# EAGLE design sensorboard_spectrometer_rev0 (EAGLE 6.5.0)
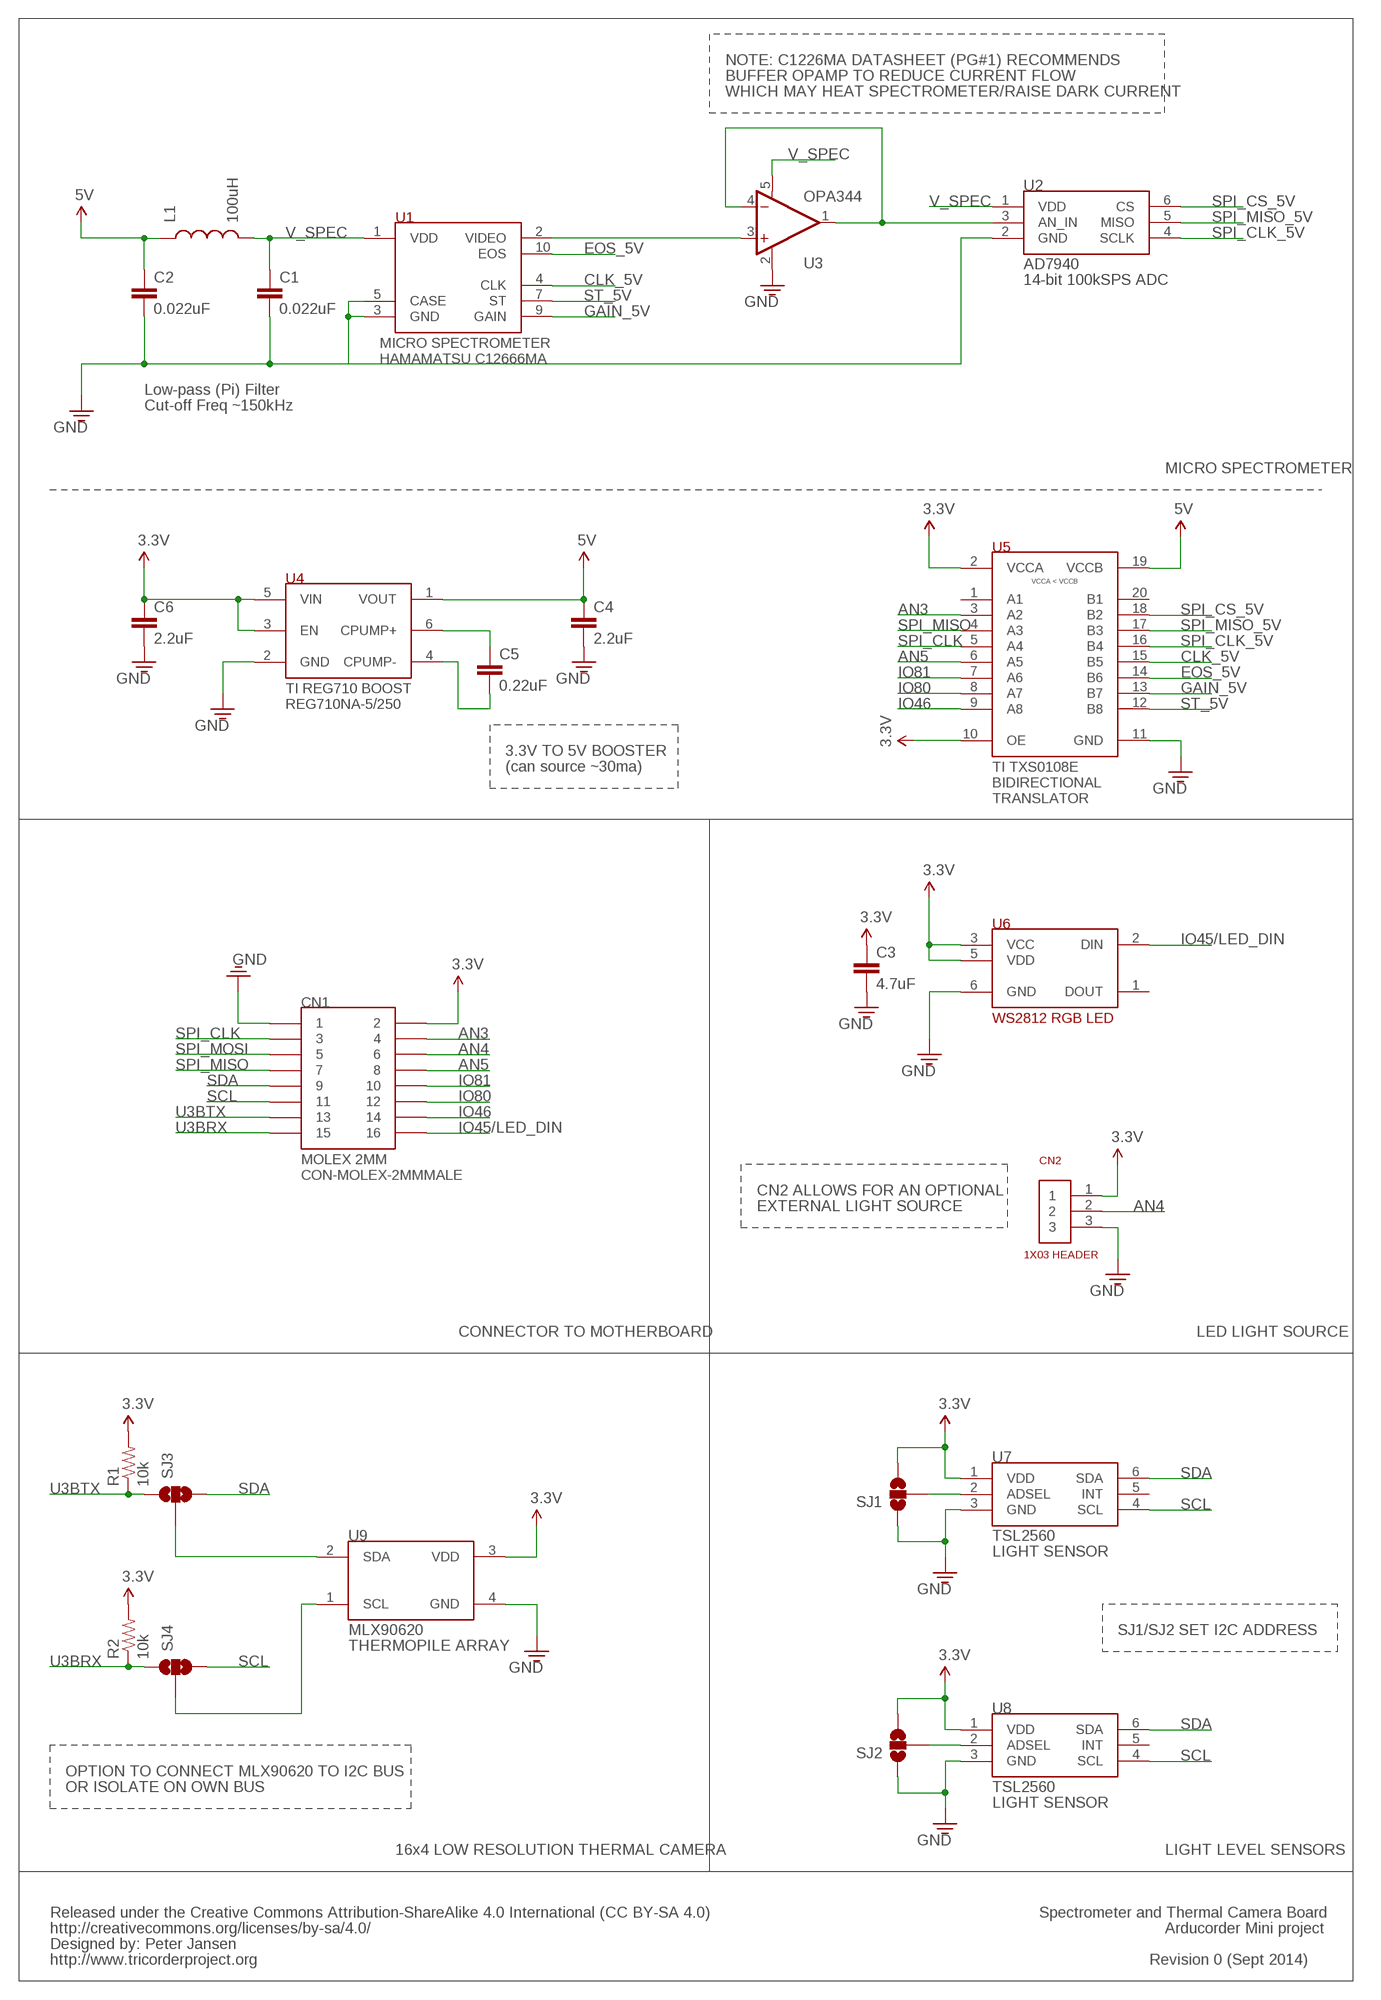
[diagram p0: schematic, sheet 1]

## Parts
C1  0.022uF  CAP0603  [0603]
C2  0.022uF  CAP0603  [0603]
C3  4.7uF  CAP0603  [0603]
C4  2.2uF  CAP0603  [0603]
C5  0.22uF  CAP0603  [0603]
C6  2.2uF  CAP0603  [0603]
CN1  CON-MOLEX-2MMMALE  [MOLEX-0877591650]
CN2  1X03  [1X03]
L1  100uH  INDUCTOR0805  [0805]
R1  10k  RESISTOR0603  [0603]
R2  10k  RESISTOR0603  [0603]
SJ1  SOLDERJUMPER_2WAYPASTE1&2  [SJ_3_PASTE1&2]
SJ2  SOLDERJUMPER_2WAYPASTE2&3  [SJ_3_PASTE2&3]
SJ3  SOLDERJUMPER_2WAYPASTE1&2  [SJ_3_PASTE1&2]
SJ4  SOLDERJUMPER_2WAYPASTE1&2  [SJ_3_PASTE1&2]
U1  MICROSPEC-C12666MA  [C12666MA]
U2  AD7940  [SOT-23-6L]
U3  OPA344  [SOT23-5]
U4  REG710NA-5/250  TI-REG710  [SOT-23-6L]
U5  TRANSLATOR-TXS0108E  [TSSOP-20]
U6  WS2812_NEOPIXEL  [WS2812]
U7  TSL2561  [TMB-6]
U8  TSL2561  [TMB-6]
U9  MLX90620  [MLX90620]

## Nets
3.3V: C3.1 C6.1 CN1.2 CN2.1 R1.2 R2.2 SJ1.3 SJ2.3 U4.3(EN) U4.5(VIN) U5.2(VCCA) U5.10(OE) U6.3(VCC) U6.5(VDD) U7.1(VDD) U8.1(VDD) U9.3(VDD)
5V: C2.1 C4.1 L1.1 U4.1(VOUT) U5.19(VCCB)
AN3: CN1.4 U5.3(A2)
AN4: CN1.6 CN2.2
AN5: CN1.8 U5.6(A5)
CLK_5V: U1.4(CLK) U5.15(B5)
EOS_5V: U1.10(EOS) U5.14(B6)
GAIN_5V: U1.9(GAIN) U5.13(B7)
GND: C1.2 C2.2 C3.2 C4.2 C6.2 CN1.1 CN2.3 SJ1.1 SJ2.1 U1.3(GND) U1.5(CASE) U2.2(GND) U3.2(V-) U4.2(GND) U5.11(GND) U6.6(GND) U7.3(GND) U8.3(GND) U9.4(GND)
IO45/LED_DIN: CN1.16 U6.2(DIN)
IO46: CN1.14 U5.9(A8)
IO80: CN1.12 U5.8(A7)
IO81: CN1.10 U5.7(A6)
N$1: U2.3(AN_IN) U3.1(OUT) U3.4(-IN)
N$2: U1.2(VIDEO) U3.3(+IN)
N$3: SJ2.2 U8.2(ADSEL)
N$4: SJ1.2 U7.2(ADSEL)
N$7: C5.1 U4.6(CPUMP+)
N$8: C5.2 U4.4(CPUMP-)
N$10: SJ4.2 U9.1(SCL)
N$13: SJ3.2 U9.2(SDA)
SCL: CN1.11 SJ4.3 U7.4(SCL) U8.4(SCL)
SDA: CN1.9 SJ3.3 U7.6(SDA) U8.6(SDA)
SPI_CLK: CN1.3 U5.5(A4)
SPI_CLK_5V: U2.4(SCLK) U5.16(B4)
SPI_CS_5V: U2.6(CS) U5.18(B2)
SPI_MISO: CN1.7 U5.4(A3)
SPI_MISO_5V: U2.5(MISO) U5.17(B3)
SPI_MOSI: CN1.5
ST_5V: U1.7(ST) U5.12(B8)
U3BRX: CN1.15 R2.1 SJ4.1
U3BTX: CN1.13 R1.1 SJ3.1
V_SPEC: C1.1 L1.2 U1.1(VDD) U2.1(VDD) U3.5(V+)
Unconnected: U5.1(A1) U5.20(B1) U6.1(DOUT) U7.5(INT) U8.5(INT)

## Notes on the sheet
- NOTE: C1226MA DATASHEET (PG#1) RECOMMENDS
- BUFFER OPAMP TO REDUCE CURRENT FLOW
- WHICH MAY HEAT SPECTROMETER/RAISE DARK CURRENT
- Low-pass (Pi) Filter
- Cut-off Freq ~150kHz
- MICRO SPECTROMETER
- 3.3V TO 5V BOOSTER
- (can source ~30ma)
- CN2 ALLOWS FOR AN OPTIONAL
- EXTERNAL LIGHT SOURCE
- CONNECTOR TO MOTHERBOARD | LED LIGHT SOURCE
- SJ1/SJ2 SET I2C ADDRESS
- OPTION TO CONNECT MLX90620 TO I2C BUS
- OR ISOLATE ON OWN BUS
- 16x4 LOW RESOLUTION THERMAL CAMERA | LIGHT LEVEL SENSORS
- Released under the Creative Commons Attribution-ShareAlike 4.0 International (CC BY-SA 4.0) | Spectrometer and Thermal Camera Board
- http://creativecommons.org/licenses/by-sa/4.0/ | Arducorder Mini project
- Designed by: Peter Jansen
- http://www.tricorderproject.org | Revision 0 (Sept 2014)

## Library data of the parts
C1 C2 = notes_mark5:CAP: Capacitor Standard 0603 ceramic capacitor, and 0.1" leaded capacitor.
C3 = notes_mark5a:CAP: Capacitor Standard 0603 ceramic capacitor, and 0.1" leaded capacitor.
C4-C6 = arducorder-mini:CAP: Capacitor Standard 0603 ceramic capacitor, and 0.1" leaded capacitor.
CN1 = notes-arducorder-mini:CON-MOLEX-2MM: Molex 2mm pitch connectors. (87368-1624, 0877591650)
CN2 = arducorder-mini:1X03
L1 = SparkFun-Passives:INDUCTOR: Inductors Basic Inductor/Choke - 0603 and 1206. Footprints are not proven and vary greatly between part numbers.
R1 R2 = arducorder-mini:RESISTOR: Resistor Basic schematic elements and footprints for 0603, 1206, and PTH 1/10th watt (small) resistors.
SJ1-SJ4 = SparkFun-Passives:SOLDERJUMPER_2WAY: Solder Jumper 2 way solder jumper
U1 = arducorder-mini:MICROSPEC-C12666MA: Hamamatsu Micro-Spectrometer C12666MA 350-750nm
U2 = notes_mark5:AD7940: Analog Devices AD7940 14-bit ADC, 100k Samples/sec sample rate, 2.5-5V single supply
U3 = SparkFun-AnalogIC:OPA344: Single gate rail-to-rail output op-amp. Inputs extend 300mV past rails.
U4 = arducorder-mini:TI-REG710: Texas Instruments REG710 mini switching regulator (~30ma)
U5 = arducorder-mini:TRANSLATOR-TXS0108E: TI TXS0108 8-bit bidirectional autosensing level translator
U6 = notes_mark5a:WS2812_NEOPIXEL: WS2812 "Neopixel" RGB LED w/digital interface
U7 U8 = arducorder-mini:TSL2561: AMS-TAOS TSL2561 Light-to-Digital Converter, I2C Interface
U9 = arducorder-mini:MLX90620: MLX90620 16x4 Thermopile Array, I2C Interface

## Net classes
1 supply: width 0.178 mm
3 usbvcc: width 0.61 mm, drill 0.508 mm, clearance 0.203 mm to class 0, clearance 0.254 mm
5 USB: width 0.14 mm

## Board
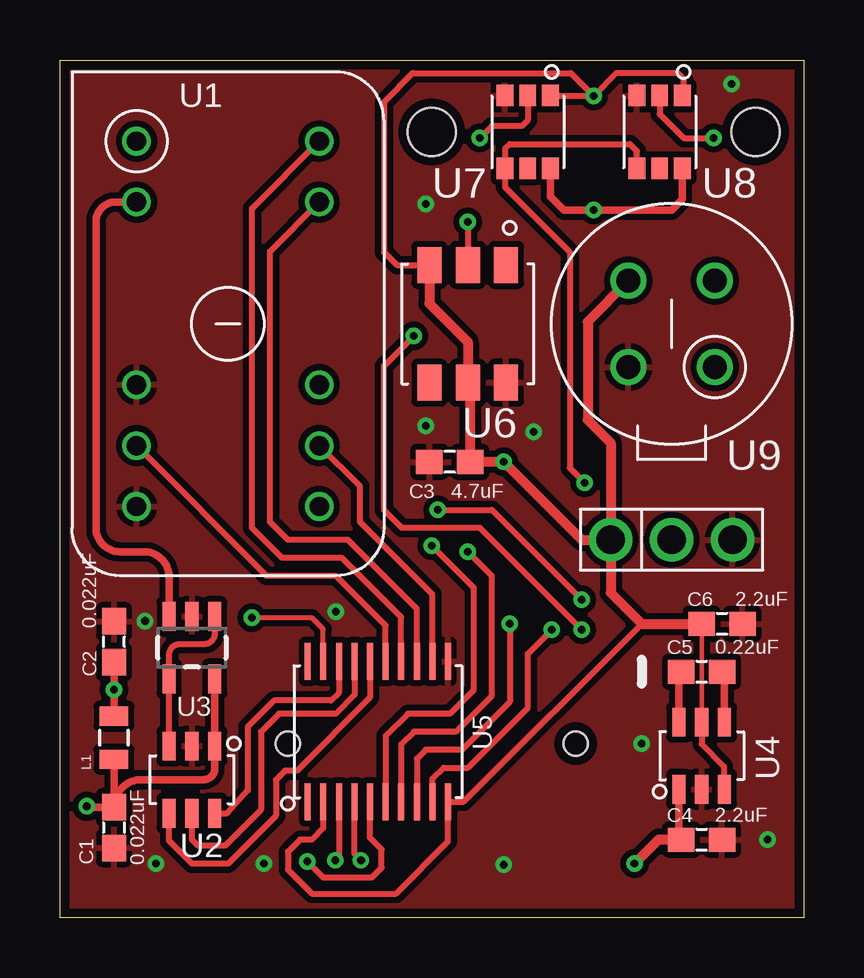
[diagram p1: board, top side]
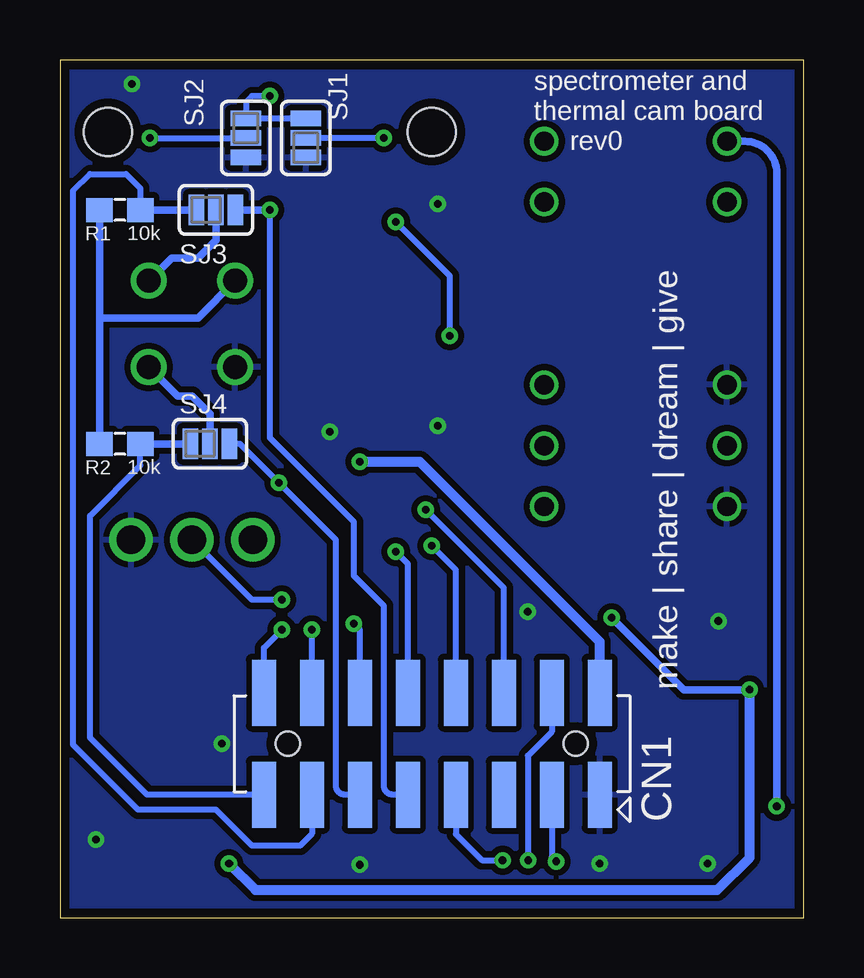
[diagram p2: board, bottom side, seen from below]

Size 31 x 35.75 mm. Coordinates in mm from the lower left corner, seen from the top.
Outline: 0,0 0,35.75 31,35.75 31,0 0,0
Copper layers (1*16): Top 0.0356mm / dielectric 1.5011mm / Bottom 0.0356mm
Design rules "default *": minimum track width 6mil, minimum drill 13mil, track to track 10mil, track to pad 7mil, pad to pad 7mil, via to via 7mil, smd to smd 7mil, copper to edge 15mil, drill to drill 6mil, minimum pad ring 7mil, minimum via ring 7mil, stop-mask expansion 3mil, vias tented up to drill 0mil, thermal gap 10mil
Holes 2 mm at 29,32.75 15.5,32.75

### Footprints (pad centres in the part's own frame; a part is rotated, then mirrored left to right if it is on the bottom)
0603 = smd 1.1 x 1: 1 -0.85,0; 2 0.85,0
MOLEX-0877591650 = smd 1 x 2.75: 1 7,-2.125; 2 7,2.125; 3 5,-2.125; 4 5,2.125; 5 3,-2.125; 6 3,2.125; 7 1,-2.125; 8 1,2.125; 9 -1,-2.125; 10 -1,2.125; 11 -3,-2.125; 12 -3,2.125; 13 -5,-2.125; 14 -5,2.125; 15 -7,-2.125; 16 -7,2.125 | hole 1: -6,0; 6,0
1X03 = drill 1.2: 1 -2.54,0; 2 0,0; 3 2.54,0
0805 = smd 0.8 x 1.2: 1 -0.9,0; 2 0.9,0
SJ_3_PASTE1&2 = smd 0.635 x 1.27: 1 -0.813,0; 2 0,0; 3 0.813,0
SJ_3_PASTE2&3 = smd 0.635 x 1.27: 1 -0.813,0; 2 0,0; 3 0.813,0
C12666MA = drill 0.8: 1 -7.62,-3.81; 2 -5.08,-3.81; 3 2.54,-3.81; 4 5.08,-3.81; 5 7.62,-3.81; 6 7.62,3.81; 7 5.08,3.81; 8 2.54,3.81; 9 -5.08,3.81; 10 -7.62,3.81
SOT-23-6L = smd 0.55 x 1.2: 1 -0.95,-1.4; 2 0,-1.4; 3 0.95,-1.4; 4 0.95,1.4; 5 0,1.4; 6 -0.95,1.4
SOT23-5 = smd 0.55 x 1.2: 1 -0.95,-1.3; 2 0,-1.3; 3 0.95,-1.3; 4 0.95,1.3; 5 -0.95,1.3
TSSOP-20 = smd 0.25 x 1.55: 1 -2.925,-2.925; 2 -2.275,-2.925; 3 -1.625,-2.925; 4 -0.975,-2.925; 5 -0.325,-2.925; 6 0.325,-2.925; 7 0.975,-2.925; 8 1.625,-2.925; 9 2.275,-2.925; 10 2.925,-2.925; 11 2.925,2.925; 12 2.275,2.925; 13 1.625,2.925; 14 0.975,2.925; 15 0.325,2.925; 16 -0.325,2.925; 17 -0.975,2.925; 18 -1.625,2.925; 19 -2.275,2.925; 20 -2.925,2.925
WS2812 = smd 1.5 x 1: 1 2.45,-1.6; 2 2.45,0; 3 2.45,1.6; 4 -2.45,1.6; 5 -2.45,0; 6 -2.45,-1.6
TMB-6 = smd 0.9 x 0.7: 1 -1.518,0.945; 2 -1.518,0; 3 -1.518,-0.945; 4 1.518,-0.945; 5 1.518,0; 6 1.518,0.945
MLX90620 = drill 1: 1 -1.796,1.796; 2 -1.796,-1.796; 3 1.796,-1.796; 4 1.796,1.796

### Placement (x,y rotation side)
C1  2.25,3.75 270 top
C2  2.25,11.5 90 top
C3  16.25,19 180 top
C4  26.75,3.25 0 top
C5  26.75,10.25 0 top
C6  27.6,12.25 0 top
CN1  15.5,7.25 0 bottom
CN2  25.5,15.75 0 top
L1  2.25,7.5 270 top
R1  28.5,29.5 180 bottom
R2  28.5,19.75 180 bottom
SJ1  20.75,32.5 90 bottom
SJ2  23.25,32.5 90 bottom
SJ3  24.5,29.5 0 bottom
SJ4  24.75,19.75 0 bottom
U1  7,24.75 270 top
U2  5.5,5.75 180 top
U3  5.5,11.25 180 top
U4  26.75,6.75 0 top
U5  13.25,7.75 0 top
U6  17,24.75 90 top
U7  19.5,32.75 270 top
U8  25,32.75 270 top
U9  25.5,24.75 180 top

### Tracks (layer width: path | path; a pad name or v marks a point on that pad's centre or on a via)
3.3V  (via drill 0.33)
  Top 0.178: C6.1 U4.5
  Top 0.254: U4.5 26.75,7.23 27.69,6.3 27.69,5.36 U4.3 | U8.1 26,34.21 26,34.95 25.75,35.2 23.2,35.2 v22.25,34.25 | U7.1 22.23,34.27 v22.25,34.25 | U6.3 14.05,27.2 13.5,27.75 13.5,34 14.7,35.2 21.3,35.2 v22.25,34.25 | U5.2 10.98,3.72 10.5,3.25 10,3.25 9.5,2.75 9.5,2 10.5,1 14,1 16.18,3.18 U5.10 16.82,4.82 24.25,12.25
  Top 0.406: U6.3 15.4,25.6 17,24 U6.5 17.1,22.2 C3.1 v18.5,19 21.75,15.75 CN2.1 | CN2.1 22.96,13.54 24.25,12.25 C6.1 | 23,15.75 CN2.1 | U9.3 22,24.84 22,20.75 22.96,19.79 CN2.1
  Bottom 0.254: SJ1.3 SJ2.3 23.25,34 23,34.25 v22.25,34.25
  Bottom 0.305: R2.2 29.35,25 | 29.35,25 R1.2 | U9.3 25.25,25 29.35,25
  Bottom 0.406: CN1.2 8.5,11.5 16,19 v18.5,19
5V  (via drill 0.33)
  Top 0.203: U5.19 10.98,12.02 10.5,12.5 v8,12.5
  Top 0.305: U4.1 25.8,3.35 C4.1 | C2.1 v2.25,9.5 L1.1
  Top 0.406: C4.1 24.95,3.25 v23.95,2.25
  Bottom 0.305: v8,12.5 5,9.5 v2.25,9.5
  Bottom 0.406: v23.95,2.25 22.85,1.15 3.6,1.15 2.25,2.5 v2.25,9.5
AN3  (via drill 0.33)
  Top 0.254: U5.3 11.62,2.53 v11.48,2.39
  Bottom 0.254: CN1.4 10.5,7.75 11.5,6.75 11.5,2.41 v11.48,2.39
AN4  (via drill 0.33)
  Top 0.254: v15.75,17 18.01,17 18.01,16.99 v21.75,13.25
  Bottom 0.254: CN1.6 12.5,13.75 v15.75,17 | v21.75,13.25 23,13.25 CN2.2
AN5  (via drill 0.33)
  Top 0.254: U5.6 13.57,7.57 14.5,8.5 16.25,8.5 17.25,9.5 17.25,13.75 v15.5,15.5
  Bottom 0.254: CN1.8 14.5,14.5 v15.5,15.5
CLK_5V
  Top 0.254: U5.15 13.57,12.18 11.5,14.25 8.61,14.25 U1.4
EOS_5V
  Top 0.254: U5.14 14.23,12.52 11.75,15 9.25,15 8,16.25 8,29.56 U1.10
GAIN_5V
  Top 0.254: U5.13 14.88,12.88 12,15.75 9.5,15.75 8.75,16.5 8.75,27.77 U1.9
GND  (via drill 0.33)
  other vias: 3.55,12.36 15.25,29.75 4,2.25 18.5,2.2 29.5,3.25 28,34.75 11.5,12.75 19.75,20.25 15.25,20.5 8.5,2.25 24.25,7.25
  pour Top: 0,35.75 0,0 31,0 31,35.75
  pour Bottom: 0,0 0,35.75 31,35.75 31,0
IO45/LED_DIN  (via drill 0.33)
  Top 0.254: v14.75,24.25 13.5,23 13.5,17 14.25,16.25 17.5,16.25 v21.75,12 | v17,29 U6.2
  Bottom 0.254: CN1.16 22.5,11.25 v21.75,12 | v14.75,24.25 14.75,26.75 v17,29
IO46  (via drill 0.33)
  Top 0.254: U5.9 15.52,5.78 16,6.25 17,6.25 19.5,8.75 19.5,11 v20.5,12
  Bottom 0.254: CN1.14 v20.5,12
IO80  (via drill 0.33)
  Top 0.254: v18.75,12.25 18.75,9 16.75,7 15.25,7 14.88,6.62 U5.8
  Bottom 0.254: CN1.12 18.5,12 v18.75,12.25
IO81  (via drill 0.33)
  Top 0.254: U5.7 14.23,7.22 14.75,7.75 16.5,7.75 18,9.25 18,14.25 v17,15.25
  Bottom 0.254: CN1.10 16.5,14.75 v17,15.25
N$1
  Top 0.254: U2.3 U3.4 4.55,10.95 arc-90 5,11.4 6.05,11.4 arc90 6.45,11.85 U3.1
N$2
  Top 0.305: U1.2 2.33,29.83 arc90 1.5,29 1.5,16.25 arc90 2.5,15.25 3.5,15.25 arc-90 4.55,14.2 U3.3
N$3  (via drill 0.33)
  Top 0.254: U8.2 25,33.5 26,32.5 v27.25,32.5
  Bottom 0.254: v27.25,32.5 SJ2.2
N$4  (via drill 0.33)
  Top 0.254: U7.2 19.5,33.25 19.25,33 18,33 v17.5,32.5
  Bottom 0.254: v17.5,32.5 SJ1.2
N$7
  Top 0.305: U4.6 25.8,10.15 C5.1
N$8
  Top 0.305: U4.4 27.7,10.15 C5.2
N$10
  Bottom 0.305: SJ4.2 24.75,21 25.5,21.75 26.09,21.75 U9.1
N$13
  Bottom 0.305: SJ3.2 24.5,28.25 25.25,27.5 26.34,27.5 U9.2
SCL  (via drill 0.33)
  Top 0.254: U8.4 24.05,31.95 23.75,32.25 18.75,32.25 18.55,32.05 U7.4 18.55,30.45 21.25,27.75 21.25,18.75 v21.88,18.12
  Bottom 0.254: CN1.11 19.12,5.12 arc90 19.5,5.5 19.5,15.75 v21.88,18.12 23.5,19.75 SJ4.3
SDA  (via drill 0.33)
  Top 0.305: U7.6 20.45,30.05 21,29.5 v22.25,29.5 25.5,29.5 25.95,29.95 U8.6
  Bottom 0.254: CN1.9 17.12,5.12 arc90 17.5,5.5 17.5,13 18.75,14.25 18.75,16.5 22.25,20 v22.25,29.5
  Bottom 0.305: v22.25,29.5 SJ3.3
SPI_CLK  (via drill 0.33)
  Top 0.254: v10.31,2.34 10.97,1.67 13,1.67 13.41,2.08 13.41,2.84 12.93,3.33 U5.5
  Bottom 0.254: CN1.3 10.5,2.52 v10.31,2.34
SPI_CLK_5V
  Top 0.254: U5.16 12.93,9.18 9.88,6.12 9.38,6.12 9,5.75 9,4.25 7,2.25 5.5,2.25 4.55,3.2 U2.4
SPI_CS_5V
  Top 0.254: U5.18 11.62,9.38 11.3,9.05 8.93,9.05 7.82,7.95 7.82,5.3 6.98,4.35 U2.6
SPI_MISO  (via drill 0.33)
  Top 0.254: v12.55,2.39 12.27,2.66 U5.4
  Bottom 0.254: CN1.7 14.5,3.47 13.41,2.39 v12.55,2.39
SPI_MISO_5V
  Top 0.254: U5.17 12.27,9.28 11.5,8.5 9.12,8.5 8.38,7.75 8.38,4.5 6.88,3 5.75,3 5.5,3.25 U2.5
ST_5V
  Top 0.254: U5.12 15.52,13.48 12.5,16.5 12.5,17.98 U1.7
U3BRX
  Bottom 0.254: CN1.15 27.38,5.12 29.75,7.5 29.75,16.75 27.65,18.85 R2.1
  Bottom 0.305: SJ4.1 R2.1
U3BTX
  Bottom 0.254: CN1.13 20.5,3.5 21,3 23,3 24.5,4.5 27.75,4.5 30.45,7.2 30.45,30.3 29.75,31 28.25,31 27.65,30.4 R1.1
  Bottom 0.305: SJ3.1 R1.1
V_SPEC  (via drill 0.33)
  Top 0.305: C1.1 L1.2 | U3.5 U2.1 6.45,6.2 arc-90 6,5.75 3.4,5.75 arc90 C1.1 | C1.1 1.15,4.6 v1.12,4.64
  Bottom 0.305: v1.12,4.64 1.12,31.04 arc-90 2.44,32.36 3.18,32.36 arc90 U1.1

### Text on the board
bPlace: spectrometer and | thermal cam board | rev0 | make | share | dream | give